# EAGLE schematic mm-001 (EAGLE 9.6.2)
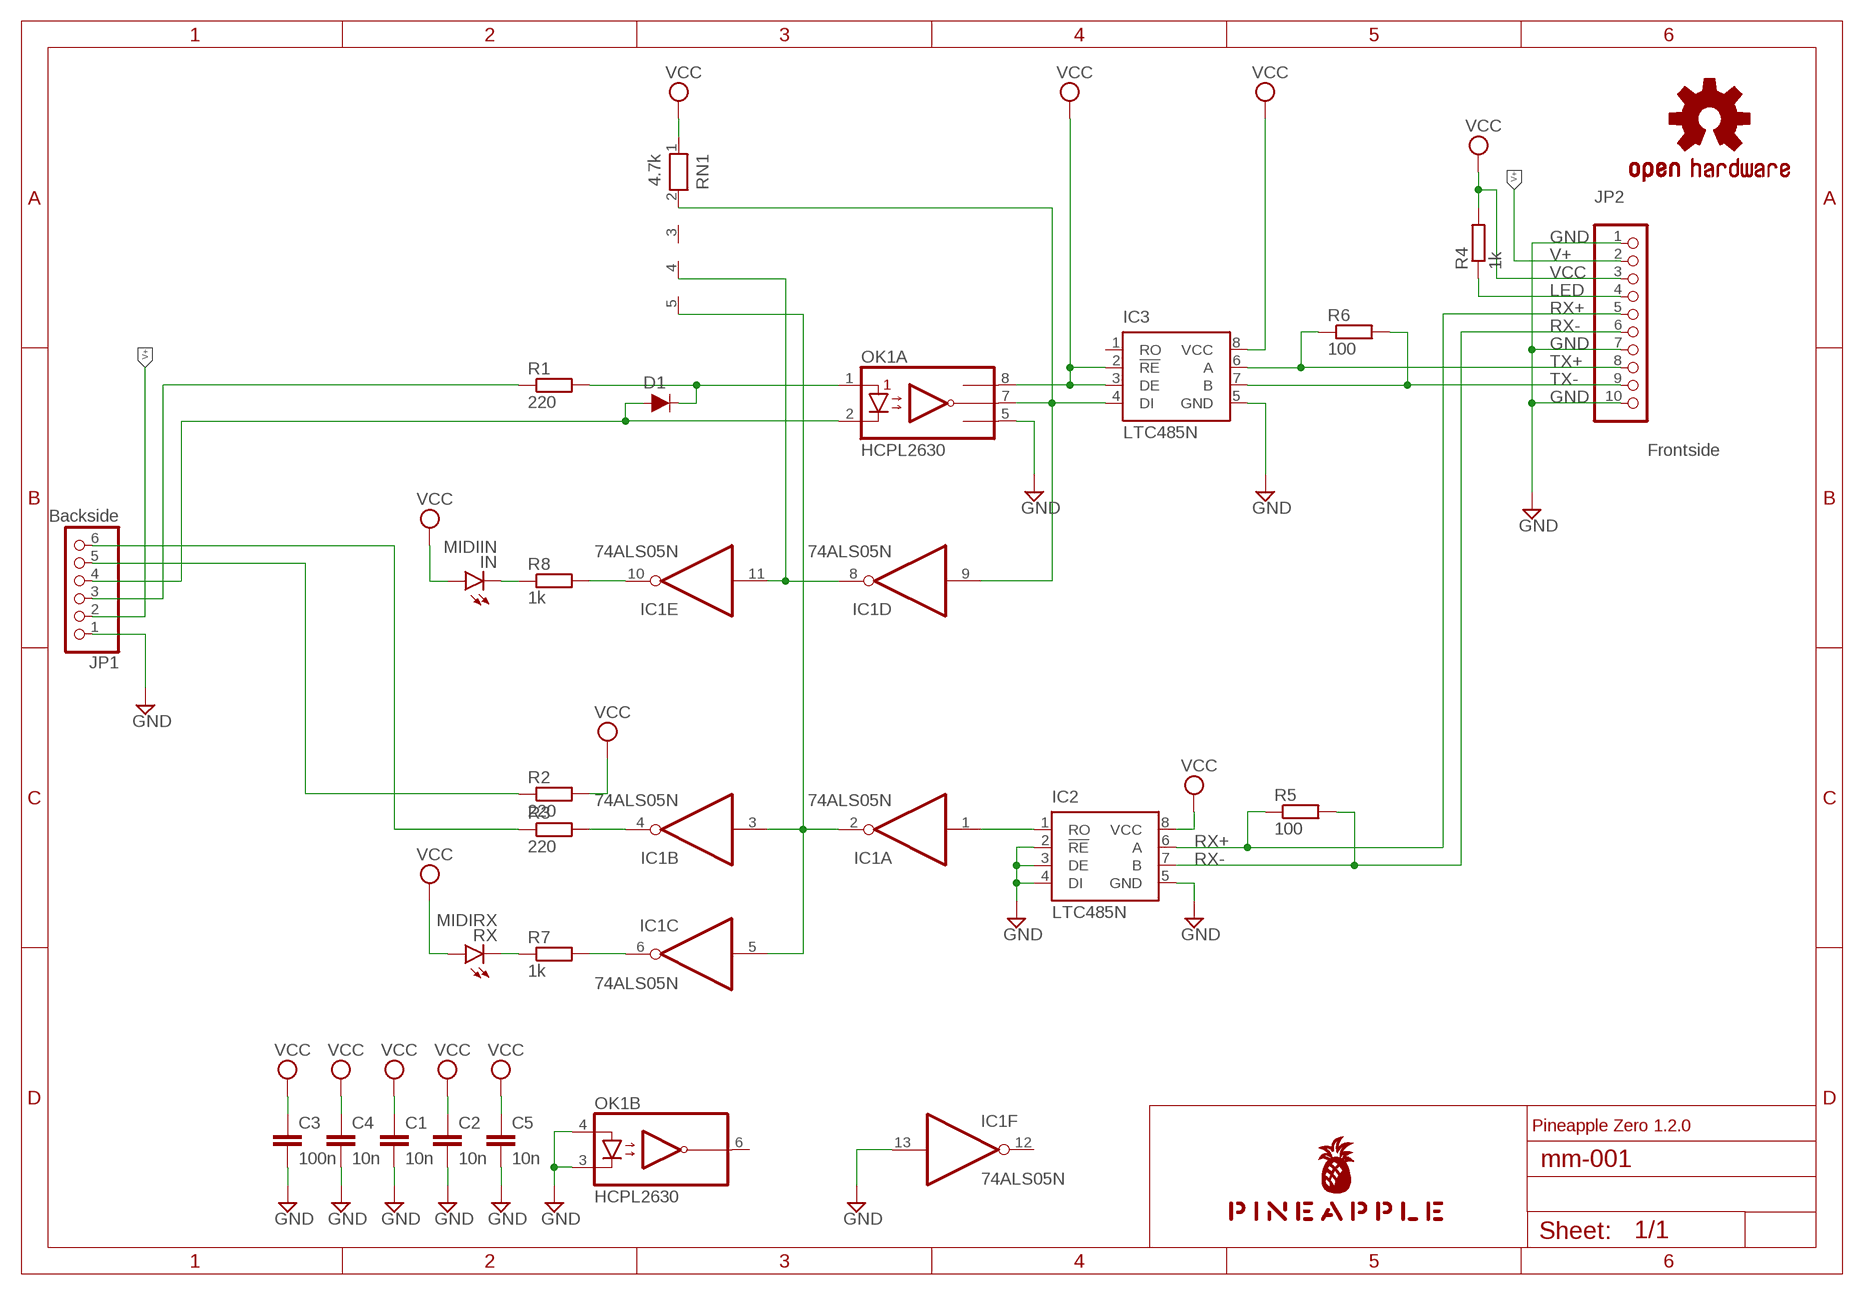
[diagram p0: schematic, sheet 1]

## Parts
C1  10n  C-EU025-024X044  [C025-024X044]
C2  10n  C-EU025-024X044  [C025-024X044]
C3  100n  C-EU025-024X044  [C025-024X044]
C4  10n  C-EU025-024X044  [C025-024X044]
C5  10n  C-EU025-024X044  [C025-024X044]
D1  DIODE-1N4148  [DIODE-1N4148]
IC1  74ALS05N  [DIL14]
IC2  LTC485N  [DIL08]
IC3  LTC485N  [DIL08]
IN  MIDIIN  LED3MM  [LED3MM]
JP1  Backside  PINHD-1X6  [1X06]
JP2  Frontside  PINHD-1X10  [1X10]
LOGO1  OSHW-LOGOS-COPPER  [OSHW-LOGO-S_COPPER]
OK1  HCPL2630  [DIL08]
R1  220  R-EU_0204/5  [0204/5]
R2  220  R-EU_0204/5  [0204/5]
R3  220  R-EU_0204/5  [0204/5]
R4  1k  R-EU_0204/5  [0204/5]
R5  100  R-EU_0204/5  [0204/5]
R6  100  R-EU_0204/5  [0204/5]
R7  1k  R-EU_0204/5  [0204/5]
R8  1k  R-EU_0204/5  [0204/5]
RN1  4.7k  RN04  [RN-5]
RX  MIDIRX  LED3MM  [LED3MM]
U$1  PINEAPPLE450  [PINEAPPLE450]

## Nets
GND [gnd]: C1.2 C2.2 C3.2 C4.2 C5.2 IC1.13(F:I) IC2.2(!RE) IC2.3(DE) IC2.4(DI) IC2.5(GND) IC3.5(GND) JP1.1 JP2.1 JP2.7 JP2.10 OK1.3(B:C2) OK1.4(B:A2) OK1.5(A:GND)
LED: JP2.4 R4.1
LED1: IC1.6(C:O) R7.2
LED1K: R7.1 RX.K(C)
LED2: IC1.10(E:O) R8.2
LED2K: IN.K(C) R8.1
MIDIIN: D1.C OK1.1(A:A1) R1.2
MIRTN: D1.A JP1.4 OK1.2(A:C1)
MISND: JP1.3 R1.1
MORTN: JP1.6 R3.1
MOSND: JP1.5 R2.1
N$1: IC1.1(A:I) IC2.1(RO)
N$2: IC1.4(B:O) R3.2
N$5: IC1.8(D:O) IC1.11(E:I) RN1.4
NMIDIOUT: IC1.2(A:O) IC1.3(B:I) IC1.5(C:I) RN1.5
RX+: IC2.6(A) JP2.5 R5.1
RX-: IC2.7(B) JP2.6 R5.2
TX: IC1.9(D:I) IC3.4(DI) OK1.7(A:VO1) RN1.2
TX+: IC3.6(A) JP2.8 R6.1
TX-: IC3.7(B) JP2.9 R6.2
V+ [gnd]: JP1.2 JP2.2
VCC [pwr]: C1.1 C2.1 C3.1 C4.1 C5.1 IC2.8(VCC) IC3.2(!RE) IC3.3(DE) IC3.8(VCC) IN.A JP2.3 OK1.8(A:VCC) R2.2 R4.2 RN1.1 RX.A
Unconnected: IC1.12(F:O) IC3.1(RO) OK1.6(B:VO2) RN1.3

## Notes on the sheet
- Pineapple Zero 1.2.0

## Power pins joined to a net without a drawn wire
GND: IC1.7(P:GND)
VCC: IC1.14(P:VCC)

## Library data of the parts
C1-C5 = rcl:C-EU: CAPACITOR, European symbol; SPICEPREFIX: C
D1 = SparkFun-DiscreteSemi:DIODE: Diode These are standard reverse protection diodes and small signal diodes. SparkFun Products: SparkFun SparkPunk Sound Kit <https://www.sparkfun.com/products/11177> SparkFun ESP8266 Thing <https://www.sparkfun.com/products/13231>; PROD_ID: DIO-08378; VALUE: 200mA/100V/1V
IC1 = 74xx-us:74*05: Hex INVERTER, open collector
IC2 IC3 = linear-technology:LTC485: Low Power RS485 Interface Transceiver Source: http://www.linear.com/pc/downloadDocument.do?navId=H0,C1,C1007,C1017,P2064,D1718; OC_FARNELL: unknown; OC_NEWARK: unknown
IN RX = led:LED: LED OSRAM: - CHIPLED LG R971, LG N971, LY N971, LG Q971, LY Q971, LO R971, LY R971 LH N974, LH R974 LS Q976, LO Q976, LY Q976 LO Q996 - Hyper CHIPLED LW Q18S LB Q993, LB Q99A, LB R99A - SideLED LS A670, LO A670, LY A670, LG A670, LP A670 LB A673, LV A673, LT A673, LW A673 LH A674 LY A675 LS A676, LA A676, LO A676, LY A676, LW A676 LS A679, LY A679, LG A679 - Hyper Micro SIDELED® LS Y876, LA Y876, LO Y876, LY Y876 LT Y87S - SmartLED LW L88C, LW L88S LB L89C, LB L89S, LG L890 LS L89K, LO L89K, LY L89K LS L896, LA L896, LO L896, LY L896 - TOPLED LS T670, LO T670, LY T670, LG T670, LP T670 LSG T670, LSP T670, LSY T670, LOP T670, LYG T670 LG T671, LOG T671, LSG T671 LB T673, LV T673, LT T673, LW T673 LH T674 LS T676, LA T676, LO T676, LY T676, LB T676, LH T676, LSB T676, LW T676 LB T67C, LV T67C, LT T67C, LS T67K, LO T67K, LY T67K, LW E67C LS E67B, LA E67B, LO E67B, LY E67B, LB E67C, LV E67C, LT E67C LW T67C LS T679, LY T679, LG T679 LS T770, LO T770, LY T770, LG T770, LP T770 LB T773, LV T773, LT T773, LW T773 LH T774 LS E675, LA E675, LY E675, LS T675 LS T776, LA T776, LO T776, LY T776, LB T776 LHGB T686 LT T68C, LB T68C - Hyper Mini TOPLED® LB M676 - Mini TOPLED Santana® LG M470 LS M47K, LO M47K, LY M47K Source: http://www.osram.convergy.de LUXEON: - LUMILED® LXK2-PW12-R00, LXK2-PW12-S00, LXK2-PW14-U00, LXK2-PW14-V00 LXK2-PM12-R00, LXK2-PM12-S00, LXK2-PM14-U00 LXK2-PE12-Q00, LXK2-PE12-R00, LXK2-PE12-S00, LXK2-PE14-T00, LXK2-PE14-U00 LXK2-PB12-K00, LXK2-PB12-L00, LXK2-PB12-M00, LXK2-PB14-N00, LXK2-PB14-P00, LXK2-PB14-Q00 LXK2-PR12-L00, LXK2-PR12-M00, LXK2-PR14-Q00, LXK2-PR14-R00 LXK2-PD12-Q00, LXK2-PD12-R00, LXK2-PD12-S00 LXK2-PH12-R00, LXK2-PH12-S00 LXK2-PL12-P00, LXK2-PL12-Q00, LXK2-PL12-R00 Source: www.luxeon.com KINGBRIGHT: KA-3528ASYC Source: www.kingbright.com
JP1 = pinhead:PINHD-1X6: PIN HEADER
JP2 = pinhead:PINHD-1X10: PIN HEADER
LOGO1 = SparkFun-Aesthetics:OSHW-LOGO: Open-Source Hardware (OSHW) Logo This logo indicates the piece of hardware it is found on incorporates a OSHW license and/or adheres to the definition of open source hardware found here: http://freedomdefined.org/OSHW
OK1 = optocoupler:HCPL2630: HEWLETT PACKARD OPTO COUPLER; MF: AGILENT TECHNOLOGIES; MPN: HCPL-2630-000E; OC_FARNELL: 9994904; OC_NEWARK: 88H7813
R1-R8 = rcl:R-EU_: RESISTOR, European symbol; SPICEPREFIX: R
RN1 = resistor-net:RN04: RESISTOR NETWORK; OC_FARNELL: unknown; OC_NEWARK: unknown
U$1 = pineapple:PINEAPPLE450

## Net classes
0 default: width 0.152 mm, drill 0.152 mm, clearance 0.152 mm
1 pwr: width 0.305 mm, drill 0.152 mm, clearance 0.152 mm
2 gnd: width 0.305 mm, drill 0.152 mm, clearance 0.152 mm